# Altium schematic sheet enc28j60.SchDoc
size A4
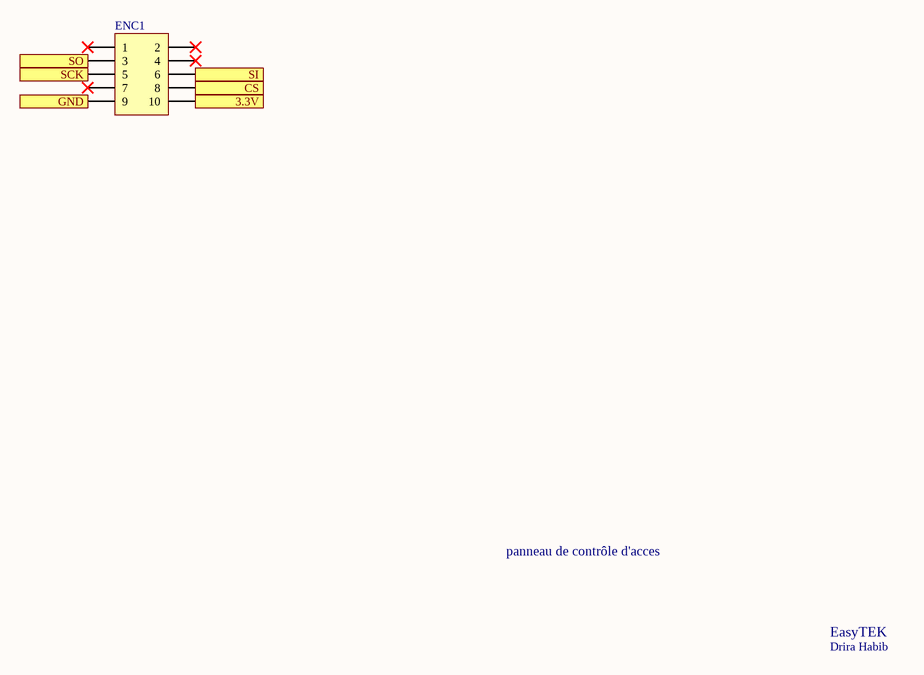
[diagram p0: enc28j60.SchDoc]

## Parts
ENC1  Header 5X2  [HDR2X5]  (value not drawn)

## Ports
3.3V, CS, GND, SCK, SI, SO

## Nets
3.3V: ENC1.10 ; port 3.3V
CS: ENC1.8 ; port CS
GND: ENC1.9 ; port GND
SCK: ENC1.5 ; port SCK
SI: ENC1.6 ; port SI
SO: ENC1.3 ; port SO

Not connected (* = marked no-connect by the designer): ENC1 1* 2* 4* 7*

## Notes on the sheet
- panneau de contrôle d'acces
- EasyTEK
- Drira Habib

## Library data of the parts
ENC1 = Header 5X2: Header, 5-Pin, Dual row; LatestRevisionDate: 17-Jul-2002; LatestRevisionNote: Re-released for DXP Platform.; Publisher: Altium Limited